# EAGLE schematic 12V-Rail IGVC 14-15 (EAGLE 7.4.0)
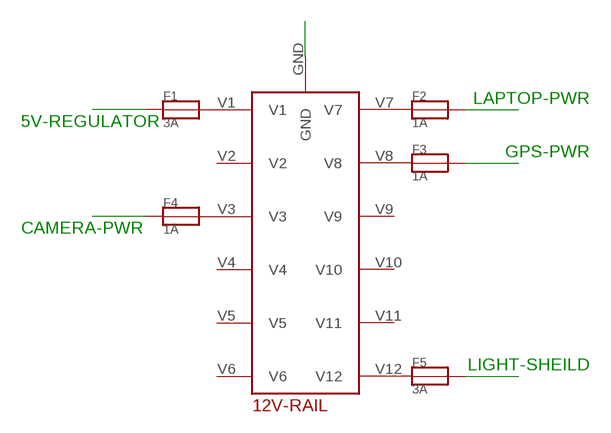
[diagram p0: schematic, sheet 1]

## Parts
12V-RAIL  FUSEBLOCK-12  [FUSEBLOCK-12PT]
F1  3A  FUSE  [FUSE]
F2  1A  FUSE  [FUSE]
F3  1A  FUSE  [FUSE]
F4  1A  FUSE  [FUSE]
F5  3A  FUSE  [FUSE]

## Nets
5V-REGULATOR: F1.P$1
CAMERA-PWR: F4.P$1
GND: 12V-RAIL.GND
GPS-PWR: F3.P$2
LAPTOP-PWR: F2.P$2
LIGHT-SHEILD: F5.P$2
N$1: 12V-RAIL.V1 F1.P$2
N$2: 12V-RAIL.V7 F2.P$1
N$3: 12V-RAIL.V8 F3.P$1
N$4: 12V-RAIL.V3 F4.P$2
N$5: 12V-RAIL.V12 F5.P$1

## Notes on the sheet
- LAPTOP-PWR
- 5V-REGULATOR
- GPS-PWR
- CAMERA-PWR
- LIGHT-SHEILD

## Power pins joined to a net without a drawn wire
V2: 12V-RAIL.V2
V4: 12V-RAIL.V4
V5: 12V-RAIL.V5
V6: 12V-RAIL.V6
V9: 12V-RAIL.V9
V10: 12V-RAIL.V10
V11: 12V-RAIL.V11

## Library data of the parts
12V-RAIL = igvc:FUSEBLOCK-12
F1-F5 = igvc:FUSE